# Altium schematic sheet PROC091F_AOP_IO.SchDoc: AOP_IO
size 431 x 279 mm; Date: Not shown in title block; ApprovedBy: Not shown in title block; CheckedBy: Not shown in title block; Author: Not shown in title block; CompanyName: Not shown in title block; DrawnBy: Antony/Bala; Engineer: Not shown in title block; Organization: Not shown in title block; Address1: Not shown in title block; Address2: Not shown in title block; Address3: Not shown in title block; Address4: Not shown in title block; DocumentNumber: 3; Revision: Use project parameter SCH_Rev; SheetNumber: 3; SheetTotal: 12; PageSetup: Record=PageOptions|CenterHorizontal=True|CenterVertical=True|PrintScale=1.00|XCorrection=1.00|YCorrection=1.00|PrintKind=0|BorderSize=5000000|LeftOffset=0|BottomOffset=0|Orientation=2|PaperLength=1000|PaperWidth=1000|Scale=100|PaperSource=15|PrintQuality=600|MediaType=1|DitherType=10|PaperKind=Letter|PrintScaleMode=1; CurrentTime: Not shown in title block; CurrentDate: Not shown in title block; Time: Not shown in title block; DocumentFullPathAndName: Not shown in title block; DocumentName: Not shown in title block; ModifiedDate: Not shown in title block; ImagePath: Not shown in title block
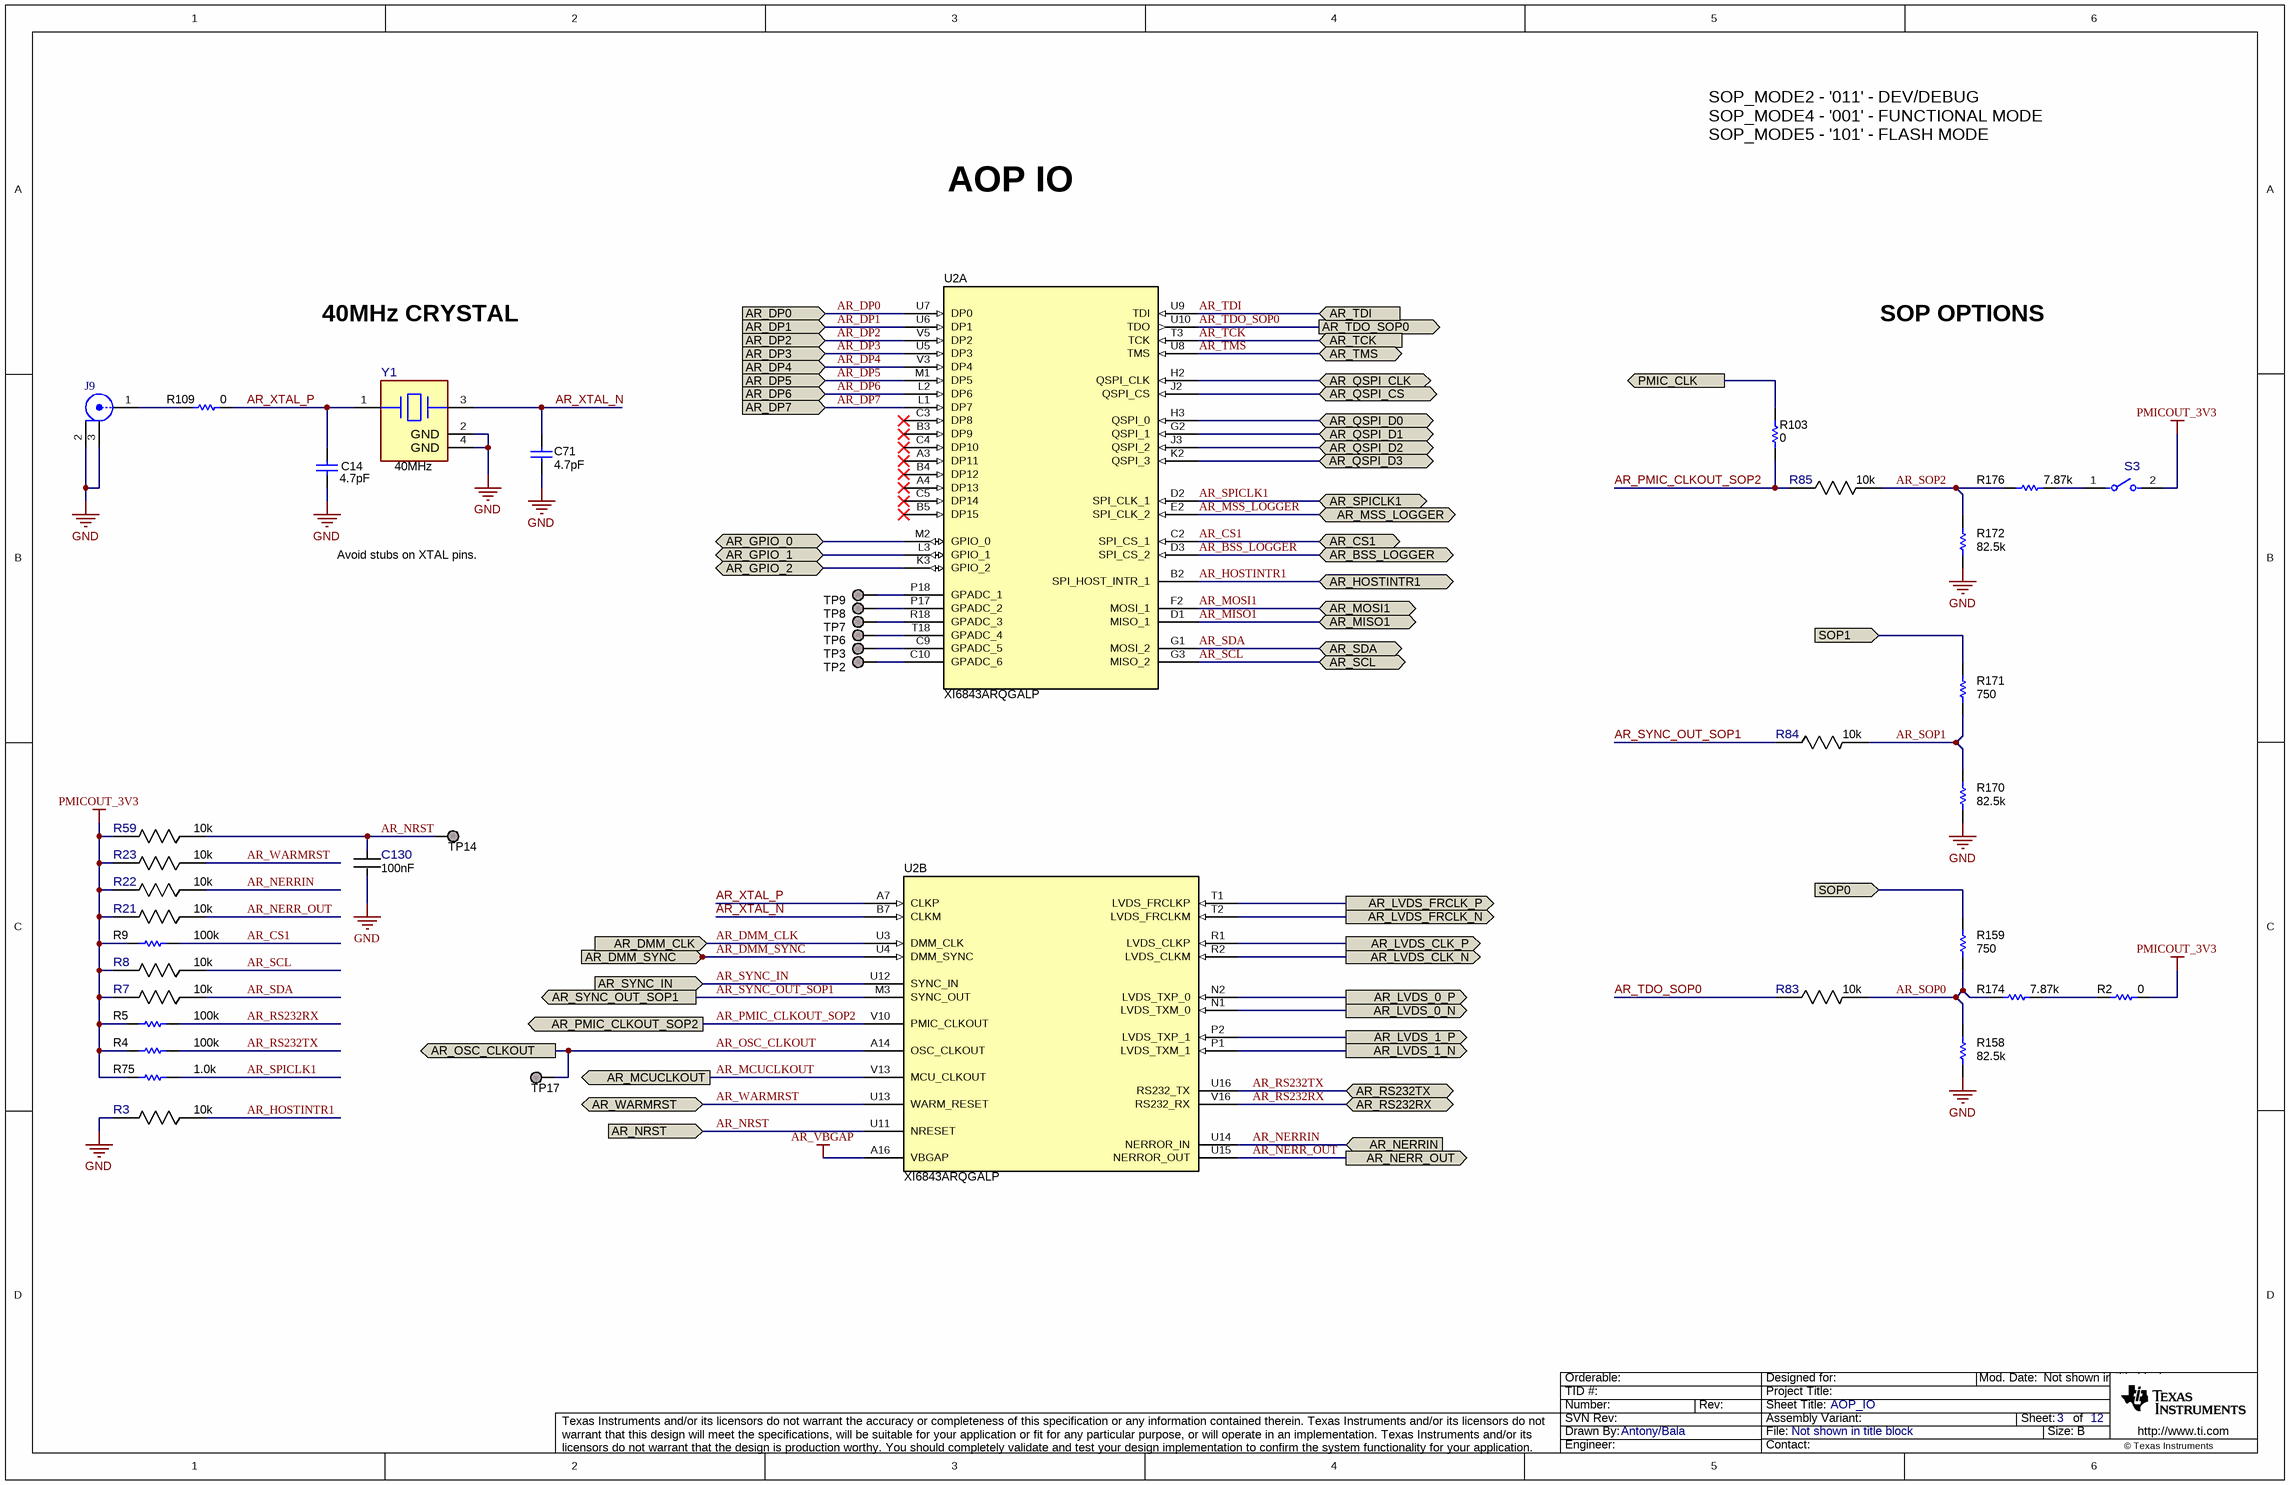
[diagram p0: PROC091F_AOP_IO.SchDoc]

## Parts
C14  value 4.7pF  [0201_033L]  (hidden comment: GRM0335C1H4R7BA01D)
C71  value 4.7pF  [0201_033L]  (hidden comment: GRM0335C1H4R7BA01D)
C130  Cap_F: 100nF  [FP-GRM033R6YA104KE14D_0201 (0603 Metric)-IPC_C]  (hidden comment: GRM033R6YA104KE14D)
J9  U.FL-R-SMT-1(01)  [CONN_UFL-R-SMT-1]  (value not drawn)
R2  Res_ohm: 0  [FP-RC0201JR-070RL_0201 (0603 Metric)-MFG]  (hidden comment: RC0201JR-070RL)
R3  Res_ohm: 10k  [FP-RR0306P-103-D_0201-IPC_C]  (hidden comment: RR0306P-103-D)
R4  value 100k  [0201L]  (hidden comment: CRCW0201100KFKED)
R5  value 100k  [0201L]  (hidden comment: CRCW0201100KFKED)
R7  Res_ohm: 10k  [FP-RR0306P-103-D_0201-IPC_C]  (hidden comment: RR0306P-103-D)
R8  Res_ohm: 10k  [FP-RR0306P-103-D_0201-IPC_C]  (hidden comment: RR0306P-103-D)
R9  value 100k  [0201L]  (hidden comment: CRCW0201100KFKED)
R21  Res_ohm: 10k  [FP-RR0306P-103-D_0201-IPC_C]  (hidden comment: RR0306P-103-D)
R22  Res_ohm: 10k  [FP-RR0306P-103-D_0201-IPC_C]  (hidden comment: RR0306P-103-D)
R23  Res_ohm: 10k  [FP-RR0306P-103-D_0201-IPC_C]  (hidden comment: RR0306P-103-D)
R59  Res_ohm: 10k  [FP-RR0306P-103-D_0201-IPC_C]  (hidden comment: RR0306P-103-D)
R75  value 1.0k  [0201L]  (hidden comment: RC0201JR-071KL)
R83  Res_ohm: 10k  [FP-RR0306P-103-D_0201-IPC_C]  (hidden comment: RR0306P-103-D)
R84  Res_ohm: 10k  [FP-RR0306P-103-D_0201-IPC_C]  (hidden comment: RR0306P-103-D)
R85  Res_ohm: 10k  [FP-RR0306P-103-D_0201-IPC_C]  (hidden comment: RR0306P-103-D)
R103  Res_ohm: 0  [FP-RC0201JR-070RL_0201 (0603 Metric)-IPC_C]  (hidden comment: RC0201JR-070RL)
R109  Res_ohm: 0  [FP-RC0201JR-070RL_0201 (0603 Metric)-MFG]  (hidden comment: RC0201JR-070RL)
R158  value 82.5k  [0201L]  (hidden comment: RC0201FR-0782K5L)
R159  value 750  [0201L]  (hidden comment: RC0201JR-07750RL)
R170  value 82.5k  [0201L]  (hidden comment: RC0201FR-0782K5L)
R171  value 750  [0201L]  (hidden comment: RC0201JR-07750RL)
R172  value 82.5k  [0201L]  (hidden comment: RC0201FR-0782K5L)
R174  value 7.87k  [0201L]  (hidden comment: RC0201FR-077K87L)
R176  value 7.87k  [0201L]  (hidden comment: RC0201FR-077K87L)
S3  CHS-01TA  [FP-CHS-01TA_SMT_SW_5MM4_2MM5-MFG]  (value not drawn)
TP2  TESTPOINT  [TP_25MIL-SMT]  (value not drawn)  (no BOM)
TP3  TESTPOINT  [TP_25MIL-SMT]  (value not drawn)  (no BOM)
TP6  TESTPOINT  [TP_25MIL-SMT]  (value not drawn)  (no BOM)
TP7  TESTPOINT  [TP_25MIL-SMT]  (value not drawn)  (no BOM)
TP8  TESTPOINT  [TP_25MIL-SMT]  (value not drawn)  (no BOM)
TP9  TESTPOINT  [TP_25MIL-SMT]  (value not drawn)  (no BOM)
TP14  TESTPOINT  [TP_25MIL-SMT]  (value not drawn)  (no BOM)
TP17  TESTPOINT  [TP_25MIL-SMT]  (value not drawn)  (no BOM)
U2  XI6843ARQGALP  [ALP0180A]  (parts A,B of 4)
Y1  Frequency_Fixed: 40MHz  [FP-CX2016DB40000D0FLJCC_SMT_2MM0_1MM6-MFG]  (hidden comment: CX2016DB40000D0FLJCC)

## Ports
AR_BSS_LOGGER (bidir), AR_CS1 (bidir), AR_DMM_CLK (in), AR_DMM_SYNC (in), AR_DP0 (in), AR_DP1 (in), AR_DP2 (in), AR_DP3 (in), AR_DP4 (in), AR_DP5 (in), AR_DP6 (in), AR_DP7 (in), AR_GPIO_0 (bidir), AR_GPIO_1 (bidir), AR_GPIO_2 (bidir), AR_HOSTINTR1 (bidir), AR_LVDS_0_N (out), AR_LVDS_0_P (out), AR_LVDS_1_N (out), AR_LVDS_1_P (out), AR_LVDS_CLK_N (out), AR_LVDS_CLK_P (out), AR_LVDS_FRCLK_N (out), AR_LVDS_FRCLK_P (out), AR_MCUCLKOUT (out), AR_MISO1 (bidir), AR_MOSI1 (bidir), AR_MSS_LOGGER (bidir), AR_NERR_OUT (out), AR_NERRIN (in), AR_NRST (in), AR_OSC_CLKOUT (out), AR_PMIC_CLKOUT_SOP2 (out), AR_QSPI_CLK (bidir), AR_QSPI_CS (bidir), AR_QSPI_D0 (bidir), AR_QSPI_D1 (bidir), AR_QSPI_D2 (bidir), AR_QSPI_D3 (bidir), AR_RS232RX (bidir), AR_RS232TX (bidir), AR_SCL (bidir), AR_SDA (bidir), AR_SPICLK1 (bidir), AR_SYNC_IN (in), AR_SYNC_OUT_SOP1 (out), AR_TCK (in), AR_TDI (in), AR_TDO_SOP0 (out), AR_TMS (bidir), AR_WARMRST (bidir), PMIC_CLK (out), SOP0 (in), SOP1 (in)

## Nets
AR_VBGAP: U2.A16(VBGAP)
GND: C14.1 C71.1 C130.2 J9.2 J9.3 R3.2 R158.1 R170.1 R172.1 Y1.2(GND) Y1.4(GND)
PMICOUT_3V3: R2.1 R4.1 R5.1 R7.2 R8.2 R9.1 R21.2 R22.2 R23.2 R59.2 R75.1 S3.2
AR_BSS_LOGGER: U2.D3(SPI_CS_2) ; port AR_BSS_LOGGER
AR_CS1: R9.2 U2.C2(SPI_CS_1) ; port AR_CS1
AR_DMM_CLK: U2.U3(DMM_CLK) ; port AR_DMM_CLK
AR_DMM_SYNC: U2.U4(DMM_SYNC) ; port AR_DMM_SYNC
AR_DP0: U2.U7(DP0) ; port AR_DP0
AR_DP1: U2.U6(DP1) ; port AR_DP1
AR_DP2: U2.V5(DP2) ; port AR_DP2
AR_DP3: U2.U5(DP3) ; port AR_DP3
AR_DP4: U2.V3(DP4) ; port AR_DP4
AR_DP5: U2.M1(DP5) ; port AR_DP5
AR_DP6: U2.L2(DP6) ; port AR_DP6
AR_DP7: U2.L1(DP7) ; port AR_DP7
AR_GPIO_0: U2.M2(GPIO_0) ; port AR_GPIO_0
AR_GPIO_1: U2.L3(GPIO_1) ; port AR_GPIO_1
AR_GPIO_2: U2.K3(GPIO_2) ; port AR_GPIO_2
AR_HOSTINTR1: R3.1 U2.B2(SPI_HOST_INTR_1) ; port AR_HOSTINTR1
AR_LVDS_0_N: U2.N1(LVDS_TXM_0) ; port AR_LVDS_0_N
AR_LVDS_0_P: U2.N2(LVDS_TXP_0) ; port AR_LVDS_0_P
AR_LVDS_1_N: U2.P1(LVDS_TXM_1) ; port AR_LVDS_1_N
AR_LVDS_1_P: U2.P2(LVDS_TXP_1) ; port AR_LVDS_1_P
AR_LVDS_CLK_N: U2.R2(LVDS_CLKM) ; port AR_LVDS_CLK_N
AR_LVDS_CLK_P: U2.R1(LVDS_CLKP) ; port AR_LVDS_CLK_P
AR_LVDS_FRCLK_N: U2.T2(LVDS_FRCLKM) ; port AR_LVDS_FRCLK_N
AR_LVDS_FRCLK_P: U2.T1(LVDS_FRCLKP) ; port AR_LVDS_FRCLK_P
AR_MCUCLKOUT: U2.V13(MCU_CLKOUT) ; port AR_MCUCLKOUT
AR_MISO1: U2.D1(MISO_1) ; port AR_MISO1
AR_MOSI1: U2.F2(MOSI_1) ; port AR_MOSI1
AR_MSS_LOGGER: U2.E2(SPI_CLK_2) ; port AR_MSS_LOGGER
AR_NERR_OUT: R21.1 U2.U15(NERROR_OUT) ; port AR_NERR_OUT
AR_NERRIN: R22.1 U2.U14(NERROR_IN) ; port AR_NERRIN
AR_NRST: C130.1 R59.1 TP14.1 U2.U11(NRESET) ; port AR_NRST
AR_OSC_CLKOUT: TP17.1 U2.A14(OSC_CLKOUT) ; port AR_OSC_CLKOUT
AR_PMIC_CLKOUT_SOP2: R85.1 R103.1 U2.V10(PMIC_CLKOUT) ; port AR_PMIC_CLKOUT_SOP2
AR_QSPI_CLK: U2.H2(QSPI_CLK) ; port AR_QSPI_CLK
AR_QSPI_CS: U2.J2(QSPI_CS) ; port AR_QSPI_CS
AR_QSPI_D0: U2.H3(QSPI_0) ; port AR_QSPI_D0
AR_QSPI_D1: U2.G2(QSPI_1) ; port AR_QSPI_D1
AR_QSPI_D2: U2.J3(QSPI_2) ; port AR_QSPI_D2
AR_QSPI_D3: U2.K2(QSPI_3) ; port AR_QSPI_D3
AR_RS232RX: R5.2 U2.V16(RS232_RX) ; port AR_RS232RX
AR_RS232TX: R4.2 U2.U16(RS232_TX) ; port AR_RS232TX
AR_SCL: R8.1 U2.G3(MISO_2) ; port AR_SCL
AR_SDA: R7.1 U2.G1(MOSI_2) ; port AR_SDA
AR_SOP0: R83.2 R158.2 R159.1 R174.2
AR_SOP1: R84.2 R170.2 R171.1
AR_SOP2: R85.2 R172.2 R176.2
AR_SPICLK1: R75.2 U2.D2(SPI_CLK_1) ; port AR_SPICLK1
AR_SYNC_IN: U2.U12(SYNC_IN) ; port AR_SYNC_IN
AR_SYNC_OUT_SOP1: R84.1 U2.M3(SYNC_OUT) ; port AR_SYNC_OUT_SOP1
AR_TCK: U2.T3(TCK) ; port AR_TCK
AR_TDI: U2.U9(TDI) ; port AR_TDI
AR_TDO_SOP0: R83.1 U2.U10(TDO) ; port AR_TDO_SOP0
AR_TMS: U2.U8(TMS) ; port AR_TMS
AR_WARMRST: R23.1 U2.U13(WARM_RESET) ; port AR_WARMRST
AR_XTAL_N: C71.2 U2.B7(CLKM) Y1.3
AR_XTAL_P: C14.2 R109.1 U2.A7(CLKP) Y1.1
PMIC_CLK: R103.2 ; port PMIC_CLK
SOP0: R159.2 ; port SOP0
SOP1: R171.2 ; port SOP1
NetJ9_1: J9.1 R109.2
NetR2_2: R2.2 R174.1
NetR176_1: R176.1 S3.1
NetTP2_1: TP2.1 U2.C10(GPADC_6)
NetTP3_1: TP3.1 U2.C9(GPADC_5)
NetTP6_1: TP6.1 U2.T18(GPADC_4)
NetTP7_1: TP7.1 U2.R18(GPADC_3)
NetTP8_1: TP8.1 U2.P17(GPADC_2)
NetTP9_1: TP9.1 U2.P18(GPADC_1)

Not connected (* = marked no-connect by the designer): U2 A3(DP11)* A4(DP13)* B3(DP9)* B4(DP12)* B5(DP15)* C3(DP8)* C4(DP10)* C5(DP14)*

## Notes on the sheet
- SOP_MODE2 - '011' - DEV/DEBUG
  SOP_MODE4 - '001' - FUNCTIONAL MODE
  SOP_MODE5 - '101' - FLASH MODE
- AOP IO
- 40MHz CRYSTAL
- SOP OPTIONS
- Avoid stubs on XTAL pins.
- Drawn By:
- SVN Rev:
- Number:
- TID #:
- Orderable:
- Rev:
- Sheet Title:
- File:
- Project Title:
- Designed for:
- Assembly Variant:
- Mod. Date:
- Sheet:
- Size:
- of
- B
- http://www.ti.com
- Texas Instruments and/or its licensors do not warrant the accuracy or completeness of this specification or any information contained therein. Texas Instruments and/or its licensors do not warrant that this design will meet the specifications, will be suitable for your application or fit for any particular purpose, or will operate in an implementation. Texas Instruments and/or its licensors do not warrant that the design is production worthy. You should completely validate and test your design implementation to confirm the system functionality for your application.
- Engineer:
- Contact:
- © Texas Instruments

## Library data of the parts
C14 C71 = CMP-0080076-1: CAP, CERM, 4.7 pF, 50 V,+/- 3%, C0G/NP0, 0201; Manufacturer: MuRata; AEC Category: Q200; AEC Qualified: N; Cap_Case: 0201; SizeArea_mm2: 0.18; SizeAreaWB_mm2: 2.08; SizeX_mm: 0.6; SizeY_mm: 0.3; SizeZ_mm: 0.33; TaMax_C: 125°C; TaMin_C: -55°C; U/M: EA; Value2: 50V; RoHS: Y; AEC Grade: N/A; Cap_F: 4.7pF; ComponentLink1Description: Datasheet link; ComponentLink1URL: https://search.murata.co.jp/Ceramy/image/img/A01X/G101/ENG/GRM0335C1H4R7BA01-01A.pdf; CompType: Capacitor; MountType: SMT; PackageReference: 0201; PartNumber: GRM0335C1H4R7BA01D; Polarized: N; Supplier 1: Digi-Key; Supplier 2: Mouser; Supplier Part Number 1: 490-11332-1-ND; Supplier Part Number 2: 81-GRM0335C1H4R7BA1D; Technology: Ceramic; TempCo: C0G/NP0; Tolerance_%: 3%; ValueDisplayed: 4.7pF; VDC_V: 50V
C130 = CMP-0086440-1: Cap Ceramic 0.1uF 35V X5R 10% Pad SMD 0201 85C T/R; Manufacturer: Murata Electronics North America; AEC Qualified: No; SizeZ_mm: 0.33mm; Symbol Name: SYM-GRM033R6YA104KE14D; TempCo: 15%; RoHS: TRUE; ComponentLink1Description: Datasheet; ComponentLink1URL: https://search.murata.co.jp/Ceramy/image/img/A01X/G101/ENG/GRM033R6YA104KE14-01.pdf; PackageReference: 0201 (0603 Metric); PartNumber: GRM033R6YA104KE14D; Tolerance_%: 10%; VDC_V: 35V
J9 = CMP-0075320-1: Receptacle, Ultra Miniature Coaxial, Male Pin, 50 ohm, SMT; Manufacturer: Hirose Electric Co. Ltd.; CNHeader: False; Gender: Female; ContactFinish: Gold; ComponentLink1URL: https://www.hirose.com/product/en/download_file/key_name/U.FL%2DR%2DSMT%2D1%2801%29/category/Drawing%20(2D)/doc_file_id/37625/?file_category_id=6&item_id=03310472201&is_series=; Supplier Part Number 2: 18K7517; Publisher: Texas Instruments; Supplier 2: Newark; Supplier Part Number 3: 798-U.FL-R-SMT01; Color: Beige; Supplier 3: Mouser; RoHS: Y; MountType: SMT; Supplier 1: Digi-Key; PackageReference: Ultra small CO-AX SMD; PinCount: 3; CompType: Receptacle; LatestRevisionDate: 2017-07-12; PartNumber: U.FL-R-SMT-1(01); Orientation: Vertical; ComponentLink1Description: Datasheet URL; Supplier Part Number 1: H122041-ND; CT: False
R2 R103 R109 = CMP-0086442-2: RES SMD 0 OHM JUMPER 1/20W 0201; Manufacturer: Yageo; AEC Qualified: No; Power_W: 50mW; SizeZ_mm: 0.26mm; TempCo: 200ppm/°C; Tolerance_%: 5%; VDC_V: 25V; RoHS: TRUE; ComponentLink1Description: Datasheet; ComponentLink1URL: http://www.yageo.com/documents/recent/PYu-RC_Group_51_RoHS_L_10.pdf; PackageReference: 0201 (0603 Metric); PartNumber: RC0201JR-070RL; Technology: Thick Film
R3 R7 R8 R21-R23 R59 R83-R85 = CMP-0088002-1: 10 kOhms ±0.5% 0.05W, 1/20W Chip Resistor 0201 (0603 Metric)  Thin Film; Manufacturer: Susumu; AEC Qualified: No; Power_W: 50mW; SizeZ_mm: 0.26mm; Symbol Name: SYM-RR0306P-103-D; TempCo: 25ppm/°C; VDC_V: 15V; RoHS: TRUE; ComponentLink1Description: Datasheet; ComponentLink1URL: https://www.susumu.co.jp/common/pdf/n_catalog_partition05_en.pdf; PackageReference: 0201; PartNumber: RR0306P-103-D; Technology: Thin Film; Tolerance_%: 0.5%
R4 R5 R9 = CMP-0027261-3: RES, 100 k, 1%, 0.05 W, 0201; Manufacturer: Vishay-Dale; AEC Category: Q200; AEC Qualified: N; EIA_Code: E96; Power_W: 50mW; SizeArea_mm2: 0.18; SizeX_mm: 0.6; SizeY_mm: 0.3; SizeZ_mm: 0.26; TempCo: 100 ppm/C; Value2: 0.05W; VDC_V: 30V; RoHS: E; AEC Grade: N/A; ComponentLink1Description: Datasheet link; ComponentLink1URL: http://www.vishay.com/docs/20052/crcw0201e3.pdf; CompType: Resistor; MountType: SMT; PackageReference: 0201; PartNumber: CRCW0201100KFKED; Res_ohm: 100k; Supplier 1: Digi-Key; Supplier 2: Newark; Supplier 3: Mouser; Supplier Part Number 1: 541-100KAABCT-ND; Supplier Part Number 2: 84R1457; Supplier Part Number 3: 71-CRCW0201100KFKED; Technology: Thick Film; Tolerance_%: 1%; Value1: 1%; Value_Code: 100k; ValueDisplayed: 100k
R75 = CMP-0027052-1: RES, 1.0 k, 5%, 0.05 W, 0201; Manufacturer: Yageo America; AEC Category: Q200; AEC Qualified: N; EIA_Code: E24; Power_W: 50mW; Res_ohm: 1k; SizeArea_mm2: 0.18; SizeX_mm: 0.6; SizeY_mm: 0.3; SizeZ_mm: 0.26; TempCo: 200 ppm/C; U/M: EA; Value2: 0.05W; Value_Code: 1k00; VDC_V: 25V; RoHS: Y; AEC Grade: N/A; ComponentLink1Description: Datasheet link; ComponentLink1URL: http://www.yageo.com/documents/recent/PYu-RC_Group_51_RoHS_L_5.pdf; CompType: Resistor; LatestRevisionDate: 2017-03-09; MountType: SMT; PackageReference: 0201; PartNumber: RC0201JR-071KL; Published: 2016-10-14; Publisher: Texas Instruments; Supplier 1: Digi-Key; Supplier 2: Mouser; Supplier Part Number 1: 311-1KNCT-ND; Supplier Part Number 2: 603-RC0201JR-071KL; Technology: Thick Film; Tolerance_%: 5%; Value1: 5%; ValueDisplayed: 1.0k
R158 R170 R172 = CMP-0027891-1: RES, 82.5 k, 1%, 0.05 W, 0201; Manufacturer: Yageo America; AEC Category: Q200; AEC Qualified: N; EIA_Code: E96; Power_W: 50mW; SizeArea_mm2: 0.18; SizeX_mm: 0.6; SizeY_mm: 0.3; SizeZ_mm: 0.26; TempCo: 200 ppm/C; U/M: EA; Value2: 0.05W; Value_Code: 82k5; VDC_V: 25V; RoHS: Y; AEC Grade: N/A; ComponentLink1Description: Datasheet link; ComponentLink1URL: http://www.yageo.com/documents/recent/PYu-RC_Group_51_RoHS_L_5.pdf; CompType: Resistor; LatestRevisionDate: 2017-03-09; MountType: SMT; PackageReference: 0201; PartNumber: RC0201FR-0782K5L; Published: 2016-10-14; Publisher: Texas Instruments; Res_ohm: 82.5k; Supplier 1: Digi-Key; Supplier 2: Mouser; Supplier Part Number 1: YAG2815CT-ND; Supplier Part Number 2: 603-RC0201FR-0782K5L; Technology: Thick Film; Tolerance_%: 1%; Value1: 1%; ValueDisplayed: 82.5k
R159 R171 = CMP-0027165-1: RES, 750, 5%, 0.05 W, 0201; Manufacturer: Yageo America; AEC Category: Q200; AEC Qualified: N; EIA_Code: E24; Power_W: 50mW; SizeArea_mm2: 0.18; SizeX_mm: 0.6; SizeY_mm: 0.3; SizeZ_mm: 0.26; TempCo: 200 ppm/C; U/M: EA; Value2: 0.05W; Value_Code: 750R; VDC_V: 25V; RoHS: Y; AEC Grade: N/A; ComponentLink1Description: Datasheet link; ComponentLink1URL: http://www.yageo.com/documents/recent/PYu-RC_Group_51_RoHS_L_5.pdf; CompType: Resistor; LatestRevisionDate: 2017-03-09; MountType: SMT; PackageReference: 0201; PartNumber: RC0201JR-07750RL; Published: 2016-10-14; Publisher: Texas Instruments; Res_ohm: 750; Supplier 1: Digi-Key; Supplier 2: Mouser; Supplier Part Number 1: YAG2927CT-ND; Supplier Part Number 2: 603-RC0201JR-07750RL; Technology: Thick Film; Tolerance_%: 5%; Value1: 5%; ValueDisplayed: 750
R174 R176 = CMP-0027880-1: RES, 7.87 k, 1%, 0.05 W, 0201; Manufacturer: Yageo America; AEC Category: Q200; AEC Qualified: N; EIA_Code: E96; Power_W: 50mW; SizeArea_mm2: 0.18; SizeX_mm: 0.6; SizeY_mm: 0.3; SizeZ_mm: 0.26; TempCo: 200 ppm/C; U/M: EA; Value2: 0.05W; Value_Code: 7k87; VDC_V: 25V; RoHS: Y; AEC Grade: N/A; ComponentLink1Description: Datasheet link; ComponentLink1URL: http://www.yageo.com/documents/recent/PYu-RC_Group_51_RoHS_L_5.pdf; CompType: Resistor; LatestRevisionDate: 2017-03-09; MountType: SMT; PackageReference: 0201; PartNumber: RC0201FR-077K87L; Published: 2016-10-14; Publisher: Texas Instruments; Res_ohm: 7.87k; Supplier 1: Digi-Key; Supplier 2: Mouser; Supplier Part Number 1: YAG2807CT-ND; Supplier Part Number 2: 603-RC0201FR-077K87L; Technology: Thick Film; Tolerance_%: 1%; Value1: 1%; ValueDisplayed: 7.87k
S3 = CMP-0087181-1: SWITCH SLIDE DIP SPST 100MA 6V; Manufacturer: Nidec Copal Electronics; PositionCount: 1; SizeZ_mm: 2.5mm; Symbol Name: SYM-CHS-01TA; RoHS: TRUE; Circuit: SPST; ComponentLink1Description: Datasheet; ComponentLink1URL: https://www.nidec-copal-electronics.com/e/catalog/switch/chs.pdf; MountType: Surface Mount; PackageReference: SMT_SW_5MM4_2MM5; PartNumber: CHS-01TA; VDC_V: 6V
TP2 TP3 TP6-TP9 TP14 TP17 = CMP-0078143-3: TEST POINT.  No entry in BOM.; CompType: Testpoint; Manufacturer: N/A; PackageReference: N/A; PartNumber: N/A; Library Reference: TESTPOINT
U2 = CMP-0860942-2: XI6843ARQGALP, ALP0180A (BGA-180); Manufacturer: Texas Instruments; SizeZ_mm: 0.965; SizeX_mm: 15; AEC Qualified: N; SizeArea_mm2: 225; SizeAreaWB_mm2: 289; CompType: IC; AEC Category: Q200; MountType: SMT; ComponentLink2URL: http://www.ti.com/product/xi6843arqg; Alternate Manufacturer: Texas Instruments; ComponentLink2Description: Product Folder; ComponentLink3Description: Online Datasheet; PackageReference: ALP0180A; ComponentLink1URL: http://www.ti.com/lit/ds/symlink/xi6843arqg.pdf; PartNumber: XI6843ARQGALP; PackageDescription: BGA-180; ComponentLink1Description: Datasheet Link; ComponentLink3URL: http://www.ti.com/product/xi6843arqg/datasheet; SizeY_mm: 15
Y1 = CMP-0087164-1: CRYSTAL 40.0000MHZ 8PF SMD; Manufacturer: Kyocera International Inc. Electronic Components; AEC Qualified: No; Frequency Stability: 15ppm; SizeZ_mm: 0.45mm; RoHS: TRUE; ComponentLink1Description: Datasheet; ComponentLink1URL: https://global.kyocera.com/prdct/electro/product/pdf/cx2016db_e.pdf; Frequency Tolerance: 15ppm; Load Capacitance: 8pF; PackageReference: SMT_2MM0_1MM6; PartNumber: CX2016DB40000D0FLJCC; Symbol Name: SYM-CX2016DB40000D0FLJCC